# Altium schematic sheet Led Indicators.SchDoc
size A; SheetNumber: 9; SheetTotal: 11
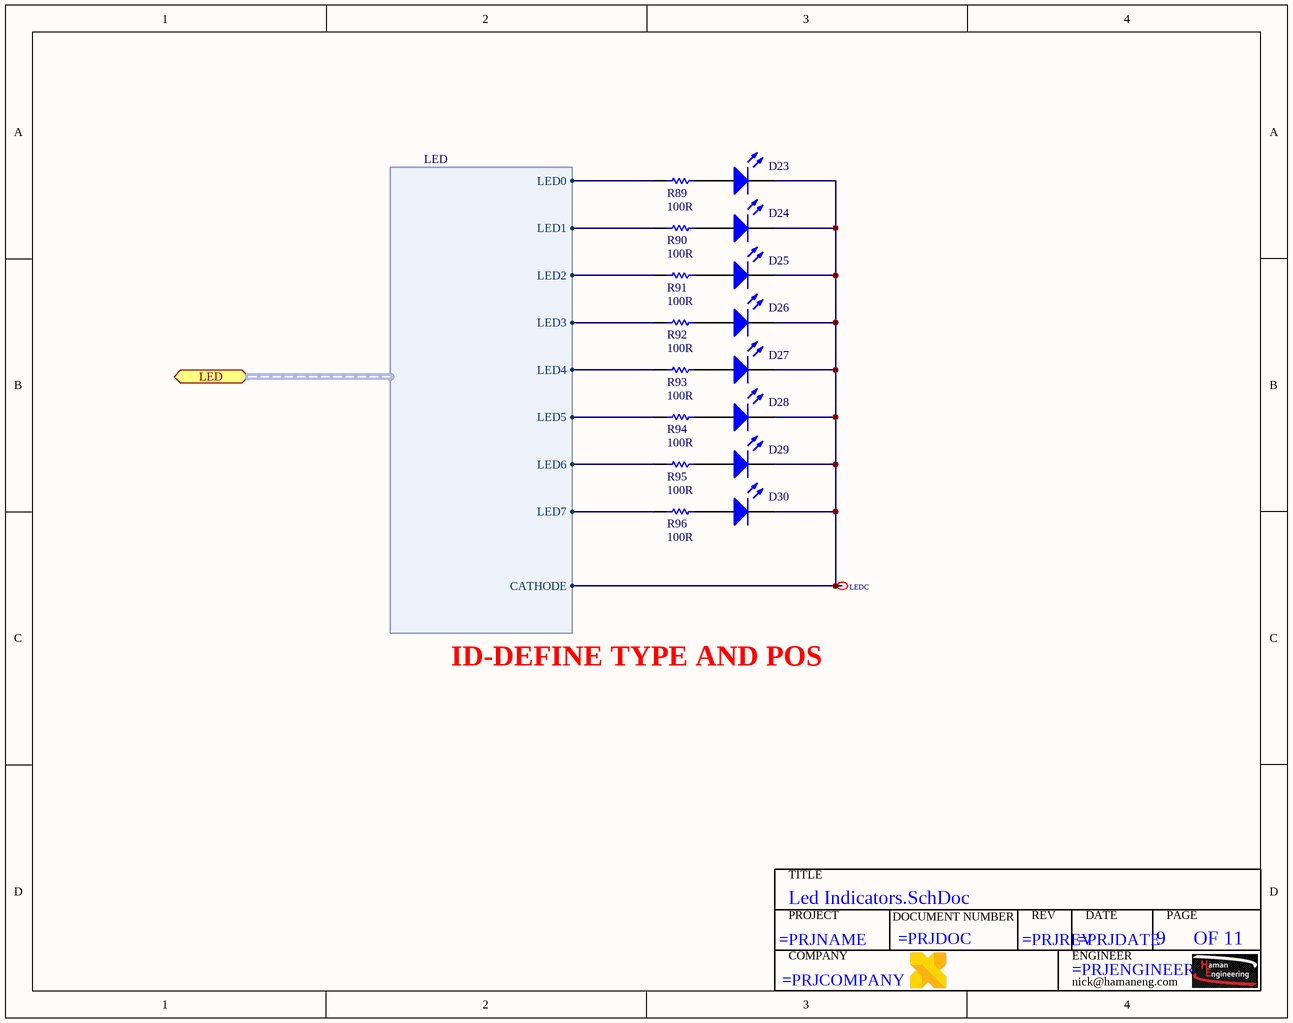
[diagram p0: Led Indicators.SchDoc]

## Parts
*?  TITLEBLOCK  (value not drawn)  (graphical)
D23  LED0  [LED-0]  (value not drawn)
D24  LED0  [LED-0]  (value not drawn)
D25  LED0  [LED-0]  (value not drawn)
D26  LED0  [LED-0]  (value not drawn)
D27  LED0  [LED-0]  (value not drawn)
D28  LED0  [LED-0]  (value not drawn)
D29  LED0  [LED-0]  (value not drawn)
D30  LED0  [LED-0]  (value not drawn)
LEDC  5001  [KEYSTONE TP]  (value not drawn)  (no BOM)
R89  Resistance: 100R  [0402R]  (hidden comment: Res 0805)
R90  Resistance: 100R  [0402R]  (hidden comment: Res 0805)
R91  Resistance: 100R  [0402R]  (hidden comment: Res 0805)
R92  Resistance: 100R  [0402R]  (hidden comment: Res 0805)
R93  Resistance: 100R  [0402R]  (hidden comment: Res 0805)
R94  Resistance: 100R  [0402R]  (hidden comment: Res 0805)
R95  Resistance: 100R  [0402R]  (hidden comment: Res 0805)
R96  Resistance: 100R  [0402R]  (hidden comment: Res 0805)

## Ports
LED (harness LED)

## Harnesses
LED: LED0, LED1, LED2, LED3, LED4, LED5, LED6, LED7, CATHODE

## Nets
NetD23_1: D23.1(A) R89.2
NetD23_2: D23.2(K) D24.2(K) D25.2(K) D26.2(K) D27.2(K) D28.2(K) D29.2(K) D30.2(K) LEDC.1 ; port LED.CATHODE
NetD24_1: D24.1(A) R90.2
NetD25_1: D25.1(A) R91.2
NetD26_1: D26.1(A) R92.2
NetD27_1: D27.1(A) R93.2
NetD28_1: D28.1(A) R94.2
NetD29_1: D29.1(A) R95.2
NetD30_1: D30.1(A) R96.2
NetR89_1: R89.1 ; port LED.LED0
NetR90_1: R90.1 ; port LED.LED1
NetR91_1: R91.1 ; port LED.LED2
NetR92_1: R92.1 ; port LED.LED3
NetR93_1: R93.1 ; port LED.LED4
NetR94_1: R94.1 ; port LED.LED5
NetR95_1: R95.1 ; port LED.LED6
NetR96_1: R96.1 ; port LED.LED7

## Notes on the sheet
- ID-DEFINE TYPE AND POS
- (in symbol TITLEBLOCK) TITLE; PROJECT; DOCUMENT NUMBER; REV; DATE; PAGE; OF; COMPANY; ENGINEER; nick@hamaneng.com

## Library data of the parts
D23-D30 = LED0: Typical INFRARED GaAs LED; Published: 8-Jun-2000; LatestRevisionDate: 08-Jul-2005; LatestRevisionNote: Mech Layer 1 removed.; PackageReference: LED-0; Publisher: Altium Limited; PackageDescription: LED; 2 Leads
LEDC = 5001: Manufacturer: Keystone Electronics; Description1: TEST POINT PC MINI .040"D BLACK; Supplier 1: Digi-Key; Manufacturer Part Number: 5001; RoHS: RoHS Compliant; Category: Test and Measurement; Stock 1: 159085; Pricing 1: 1=0.34, 10=0.315, 50=0.2296, 100=0.2206, 250=0.19812, 500=0.1891, 1000=0.15759, 2500=0.14408, 5000=0.13508 (USD); Packaging: Bulk; Type: PC Test Point, Miniature; Terminal: 0.010" x 0.020" (0.25mm x 0.51mm) Phosphor Bronze Wire, Silver Plated; Mounting Type: 0.040" (1.02mm) Hole Diameter; Material: Base, Nylon 46, UL 94V-0; Color: Black; ComponentLink1URL: http://www.keyelco.com/product-pdf.cfm?p=1310; ComponentLink1Description: http://www.keyelco.com/product-pdf.cfm?p=1310; Supplier Part Number 1: 5001K-ND
R89-R96 = Res 0805: Resistor; Manufacturer: Panasonic; Manufacturer Part Number: ERJ-2RKF1000X; Description1: Res Thick Film 0402 100 Ohm 1% 0.1W(1/10W) ±100ppm/C Molded SMD Automotive T/R; Rated Power: 0.1 W; Tolerance (%): ±1 %; Temp Coefficient: ±100 ppm/°C; Supplier 1: Digi-Key; Supplier Part Number 1: P100LCT-ND; Stock 1: 14075966; Pricing 1: 1=0.1, 10=0.056, 100=0.0227, 1000=0.0102, 2500=0.0089, 5000=0.0073 (USD); Size Code: 0402; ComponentLink1URL: https://datasheet.ciiva.com/27056/2007311-27056035.pdf; ComponentLink1Description: https://datasheet.ciiva.com/27056/2007311-27056035.pdf; ComponentLink2URL: https://datasheet.ciiva.com/11821/0900766b80f80784-11821173.pdf; ComponentLink2Description: https://datasheet.ciiva.com/11821/0900766b80f80784-11821173.pdf; ComponentLink3URL: https://datasheet.ciiva.com/46372/1678782-46372741.pdf; ComponentLink3Description: https://datasheet.ciiva.com/46372/1678782-46372741.pdf; ComponentLink4URL: https://datasheet.ciiva.com/16199/aoa0000ce2-16199575.pdf; ComponentLink4Description: https://datasheet.ciiva.com/16199/aoa0000ce2-16199575.pdf; ComponentLink5URL: https://datasheet.ciiva.com/43467/1678782-43467223.pdf; ComponentLink5Description: https://datasheet.ciiva.com/43467/1678782-43467223.pdf; ComponentLink6URL: https://datasheet.ciiva.com/30260/aoa0000ce2-30260809.pdf; ComponentLink6Description: https://datasheet.ciiva.com/30260/aoa0000ce2-30260809.pdf; ComponentLink7URL: https://datasheet.ciiva.com/9186/aoa0000ce2-9186683.pdf; ComponentLink7Description: https://datasheet.ciiva.com/9186/aoa0000ce2-9186683.pdf; ComponentLink8URL: https://datasheet.ciiva.com/16776/70260748-16776427.pdf; ComponentLink8Description: https://datasheet.ciiva.com/16776/70260748-16776427.pdf; ComponentLink9URL: https://datasheet.ciiva.com/48531/aoa0000ce2-48531067.pdf; ComponentLink9Description: https://datasheet.ciiva.com/48531/aoa0000ce2-48531067.pdf; ComponentLink10URL: https://datasheet.ciiva.com/17207/aoa0000ce2-17207980.pdf; ComponentLink10Description: https://datasheet.ciiva.com/17207/aoa0000ce2-17207980.pdf; ComponentLink11URL: https://datasheet.ciiva.com/7830/426256-7830973.pdf; ComponentLink11Description: https://datasheet.ciiva.com/7830/426256-7830973.pdf; ComponentLink12URL: https://datasheet.ciiva.com/16522/aoa0000ce2-16522621.pdf; ComponentLink12Description: https://datasheet.ciiva.com/16522/aoa0000ce2-16522621.pdf; ComponentLink13URL: https://datasheet.ciiva.com/28514/1678782-28514175.pdf; ComponentLink13Description: https://datasheet.ciiva.com/28514/1678782-28514175.pdf